# EAGLE schematic robot (EAGLE 9.3.0)
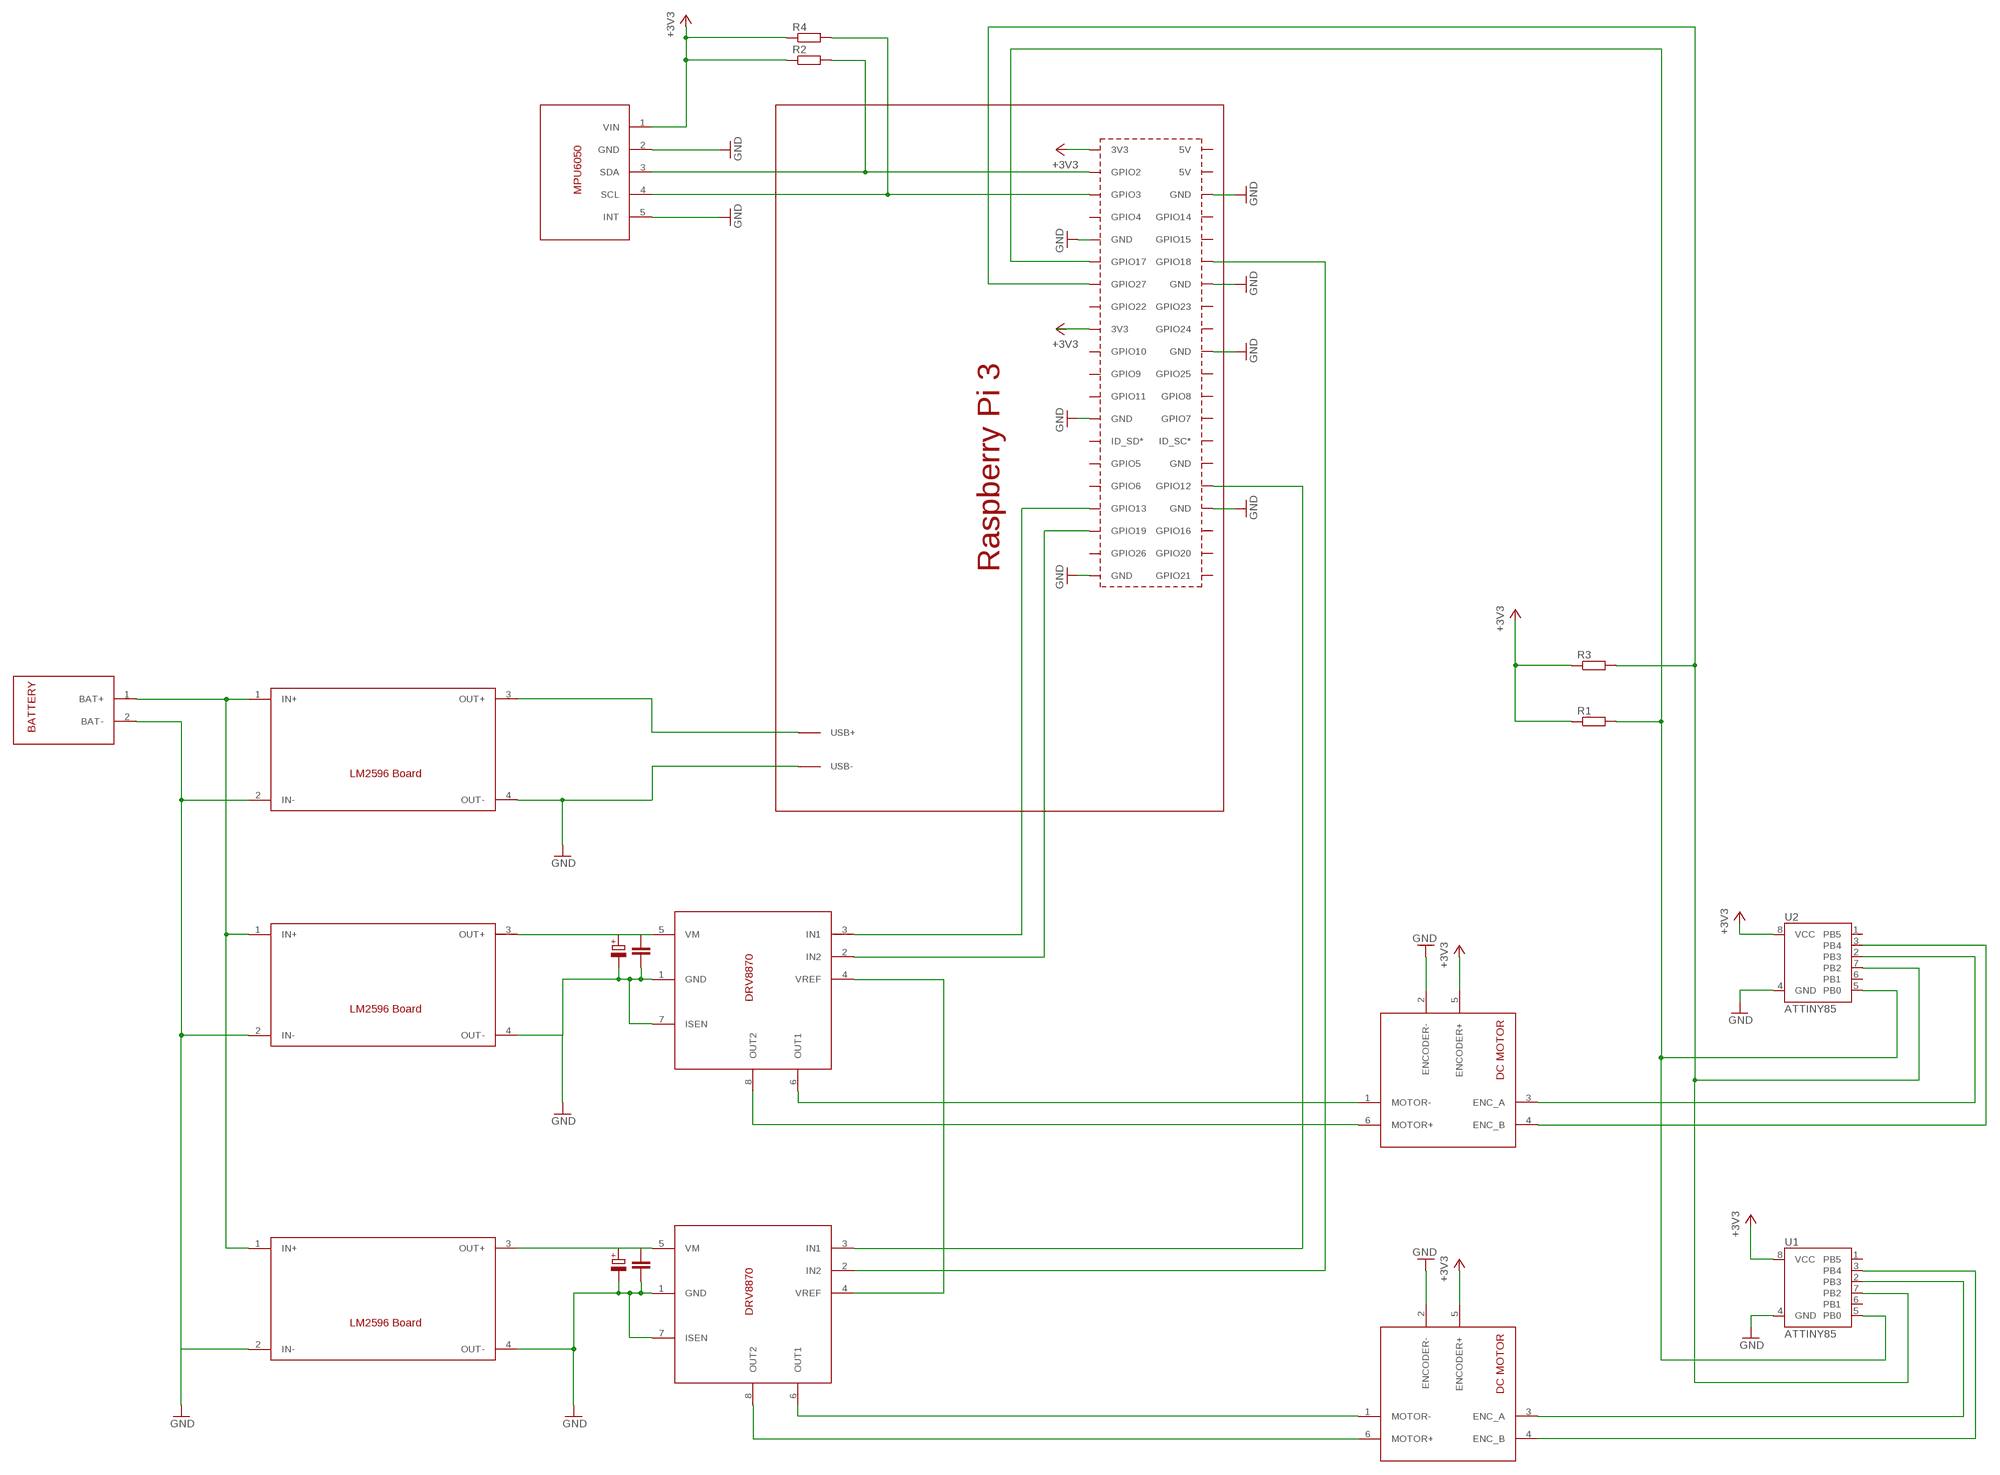
[diagram p0: schematic, sheet 1]

## Parts
PCB1  RPI3_EXT  (no package)
R1  R-EU_0204/7  [0204/7]
R2  R-EU_0204/7  [0204/7]
R3  R-EU_0204/7  [0204/7]
R4  R-EU_0204/7  [0204/7]
U1  ATTINY85  [ATTINY85]
U2  ATTINY85  [ATTINY85]
U$1  MPU6050  [1X05]
U$2  DRV8870  [DIL08]
U$3  DRV8870  [DIL08]
U$4  BATTERY  [1X02]
U$5  DCDCCONV  [DIL04]
U$6  DCDCCONV  [DIL04]
U$7  DCDCCONV  [DIL04]
U$8  DCMOTOR  [1X06]
U$9  DCMOTOR  [1X06]

## Nets
5V: PCB1.USB+ U$7.3(OUT+)
8V: U$2.5(VM) U$3.5(VM) U$5.3(OUT+) U$6.3(OUT+)
+3V3: PCB1.3V3 R1.1 R2.1 R3.1 R4.1 U1.8(VCC) U2.8(VCC) U$1.1(VIN) U$8.5(ENCODER+) U$9.5(ENCODER+)
GND: PCB1.GND PCB1.USB- U1.4(GND) U2.4(GND) U$1.2(GND) U$1.5(INT) U$2.1(GND) U$2.7(ISEN) U$3.1(GND) U$3.7(ISEN) U$4.2(BAT-) U$5.2(IN-) U$5.4(OUT-) U$6.2(IN-) U$6.4(OUT-) U$7.2(IN-) U$7.4(OUT-) U$8.2(ENCODER-) U$9.2(ENCODER-)
N$1: U$4.1(BAT+) U$5.1(IN+) U$6.1(IN+) U$7.1(IN+)
N$5: PCB1.GPIO13 U$2.3(IN1)
N$6: PCB1.GPIO19 U$2.2(IN2)
N$11: U$2.4(VREF) U$3.4(VREF)
N$12: U$2.8(OUT2) U$8.6(MOTOR+)
N$13: PCB1.GPIO12 U$3.3(IN1)
N$14: U$2.6(OUT1) U$8.1(MOTOR-)
N$15: PCB1.GPIO18 U$3.2(IN2)
N$16: U$3.8(OUT2) U$9.6(MOTOR+)
N$17: U$3.6(OUT1) U$9.1(MOTOR-)
N$18: U1.3(PB4) U$9.4(ENC_B)
N$19: U1.2(PB3) U$9.3(ENC_A)
N$20: PCB1.GPIO17 R1.2 U1.5(PB0) U2.5(PB0)
N$21: PCB1.GPIO27 R3.2 U1.7(PB2) U2.7(PB2)
N$22: U2.3(PB4) U$8.4(ENC_B)
N$23: U2.2(PB3) U$8.3(ENC_A)
N$24: PCB1.GPIO2 R2.2 U$1.3(SDA)
N$25: PCB1.GPIO3 R4.2 U$1.4(SCL)
Unconnected: PCB1.5V PCB1.GND PCB1.GPIO4 PCB1.GPIO5 PCB1.GPIO6 PCB1.GPIO7 PCB1.GPIO8 PCB1.GPIO9 PCB1.GPIO10 PCB1.GPIO11 PCB1.GPIO14 PCB1.GPIO15 PCB1.GPIO16 PCB1.GPIO20 PCB1.GPIO21 PCB1.GPIO22 PCB1.GPIO23 PCB1.GPIO24 PCB1.GPIO25 PCB1.GPIO26 PCB1.ID_SC* PCB1.ID_SD* U1.1(PB5) U1.6(PB1) U2.1(PB5) U2.6(PB1)

## Library data of the parts
PCB1 = drv8870:RPI3_EXT: Device for Raspberry Pi 3 without an associated package created by Dave Young for www.element14.com. Intended to allow the addition of a Pi3 in a schematic to show how wired connectins are made to the board without having a footprint on the board. More information available at: https://www.element14.com/community/community/raspberry-pi
R1-R4 = rcl:R-EU_: RESISTOR, European symbol; SPICEPREFIX: R
U1 U2 = SparkFun-IC-Microcontroller:ATTINY85; PROD_ID: IC-09092
U$1 = drv8870:MPU6050
U$2 U$3 = drv8870:DRV8870
U$4 = drv8870:BATTERY
U$5-U$7 = drv8870:DCDCCONV
U$8 U$9 = drv8870:DCMOTOR